# EAGLE design BJT_switch (EAGLE 9.5.0)
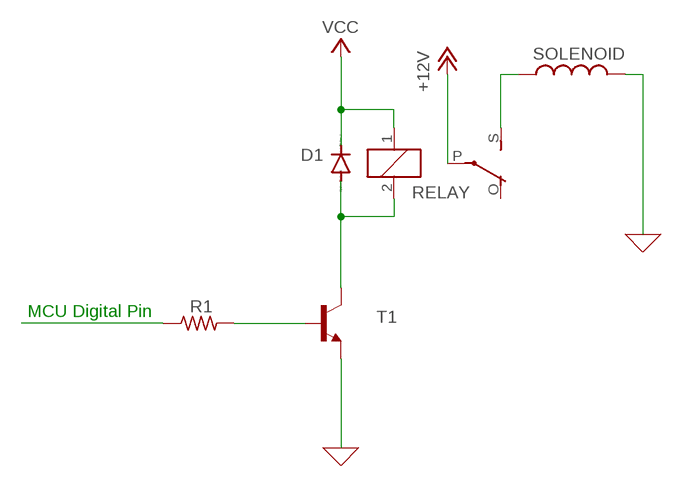
[diagram p0: schematic, sheet 1]

## Parts
D1  1N4004  [DO41-10]
L1  SOLENOID  L-US0207/5V  [0207/5V]
R1  R-US_0204/7  [0204/7]
RELAY  ZF112  [ZF112]
T1  -NPN-TO92  [TO92]

## Nets
0: L1.2 T1.1(E) ; supply symbol labelled GND
+12V: RELAY.P(2:P)
N$1: L1.1 RELAY.S(2:S)
N$2: R1.2 T1.2(B)
N$3: D1.A RELAY.2 T1.3(C)
N$4: R1.1
VCC: D1.C RELAY.1
Unconnected: RELAY.O(2:O)

## Notes on the sheet
- MCU Digital Pin

## Library data of the parts
D1 = diode:1N4004: DIODE general purpose rectifier, 1 A
L1 = rcl:L-US: INDUCTOR, American symbol; SPICEPREFIX: L
R1 = rcl:R-US_: RESISTOR, American symbol; SPICEPREFIX: R
RELAY = relay:ZF112: RELAY 1 x switch; OC_FARNELL: unknown; OC_NEWARK: unknown
T1 = transistor:*-NPN-: NPN Transistror BF959 corrected 2008.03.06

## Board
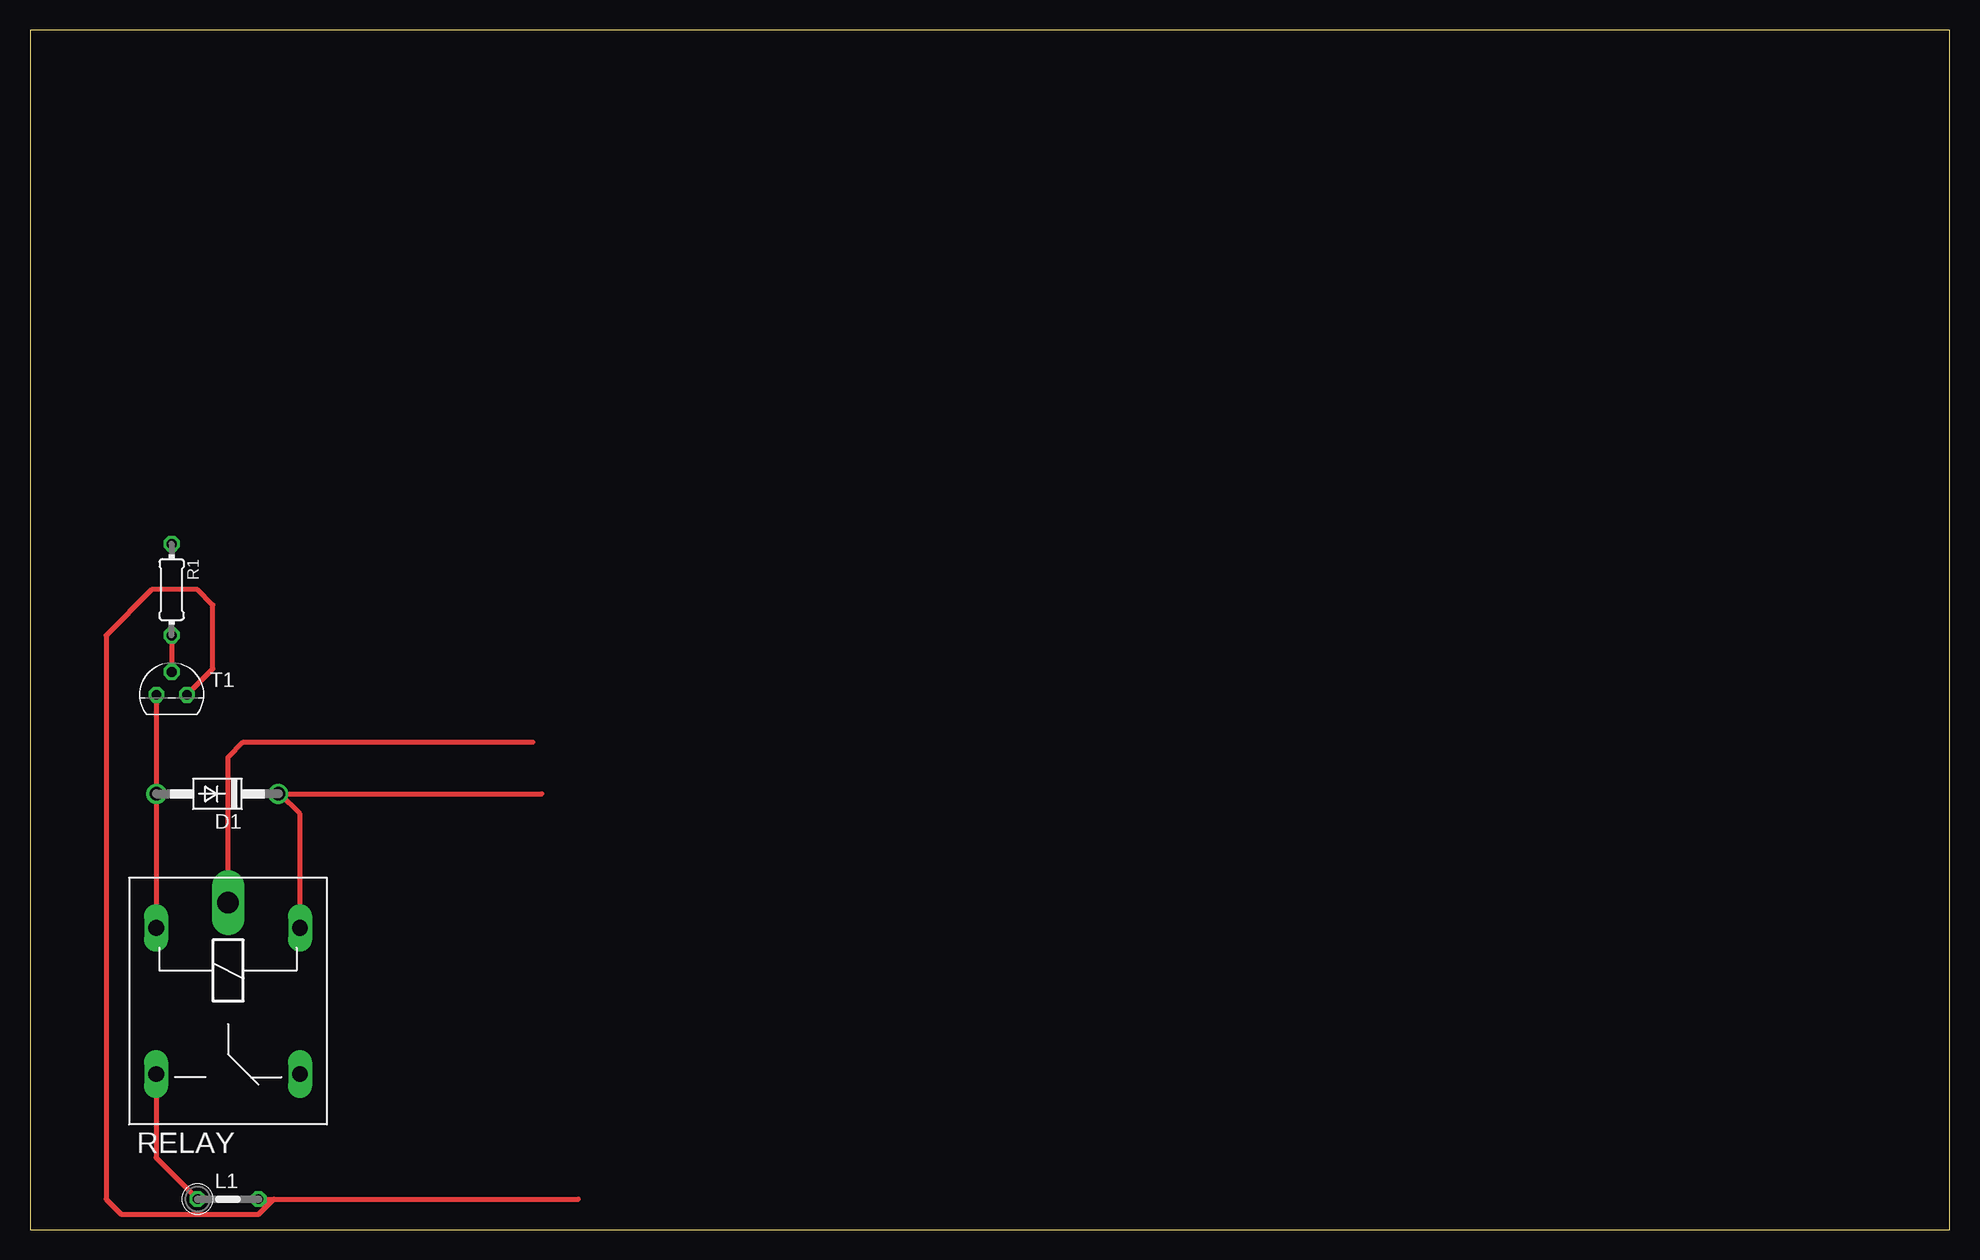
[diagram p1: board, top side]

Size 160 x 100 mm. Coordinates in mm from the lower left corner, seen from the top.
Outline: 0,0 160,0 160,100 0,100 0,0
Copper layers (1*16): Top 0.035mm / dielectric 1.5mm / Bottom 0.035mm
Design rules "default": minimum track width 6mil, minimum drill 0.35mm, track to track 6mil, track to pad 6mil, pad to pad 6mil, via to via 6mil, smd to smd 6mil, copper to edge 40mil, drill to drill 6mil, minimum pad ring 10mil, minimum via ring 8mil, stop-mask expansion 4mil, vias tented up to drill 0mil, thermal gap 10mil

### Footprints (pad centres in the part's own frame; a part is rotated, then mirrored left to right if it is on the bottom)
DO41-10 = drill 1.118: A 5.08,0; C -5.08,0
0207/5V = drill 0.813 octagon: 1 -2.54,0; 2 2.54,0
0204/7 = drill 0.813 octagon: 1 -3.81,0; 2 3.81,0
ZF112 = drill 1.321 long: 1 -6.096,5.994; 2 -6.096,-5.994; O 6.096,5.994; S 6.096,-5.994 | drill 1.803 long: P -8.204,0
TO92 = drill 0.813 octagon: 1 1.27,0; 2 0,1.905; 3 -1.27,0

### Placement (x,y rotation side)
D1  15.62,36.32 180 top
L1  16.51,2.54 0 top
R1  11.81,53.34 270 top
RELAY  16.51,19.05 270 top
T1  11.81,44.58 0 top

### Tracks (layer width: path | path; a pad name or v marks a point on that pad's centre or on a via)
0
  Top 0.406: 20.32,2.54 L1.2 19.43,2.16 | 20.32,2.54 45.72,2.54 | T1.1 15.24,46.74 15.24,52.07 13.97,53.34 10.16,53.34 6.35,49.53 6.35,2.54 7.62,1.27 19.05,1.27 19.68,1.91 | 19.68,1.91 19.94,2.16 | 19.43,2.16 19.68,1.91 | 20.32,2.54 19.94,2.16 | 19.94,2.16 19.43,2.16
+12V
  Top 0.406: RELAY.P 16.51,39.37 17.78,40.64 41.91,40.64
N$1
  Top 0.406: RELAY.S 10.52,5.99 L1.1
N$2
  Top 0.406: R1.2 T1.2
N$3
  Top 0.406: RELAY.2 10.54,25.17 10.54,35.56 D1.A T1.3
VCC
  Top 0.406: RELAY.1 22.5,34.65 20.83,36.32 D1.C 42.67,36.32